# Altium schematic sheet MCU2.SchDoc: MCU
size A3; Date: 3/31/2015; Author: P.A.; CompanyName: STMicroelectronics; Organization: Microcontrollers Division; Address1: 12, Rue Jules HOROWITZ; Address2: 38019 Grenoble; Address3: FRANCE; DocumentNumber: MB1209; Revision: D-02; SheetNumber: 2; SheetTotal: 11; Project: STM32F412G-DISCO; ModifiedDate: 6/2/2016
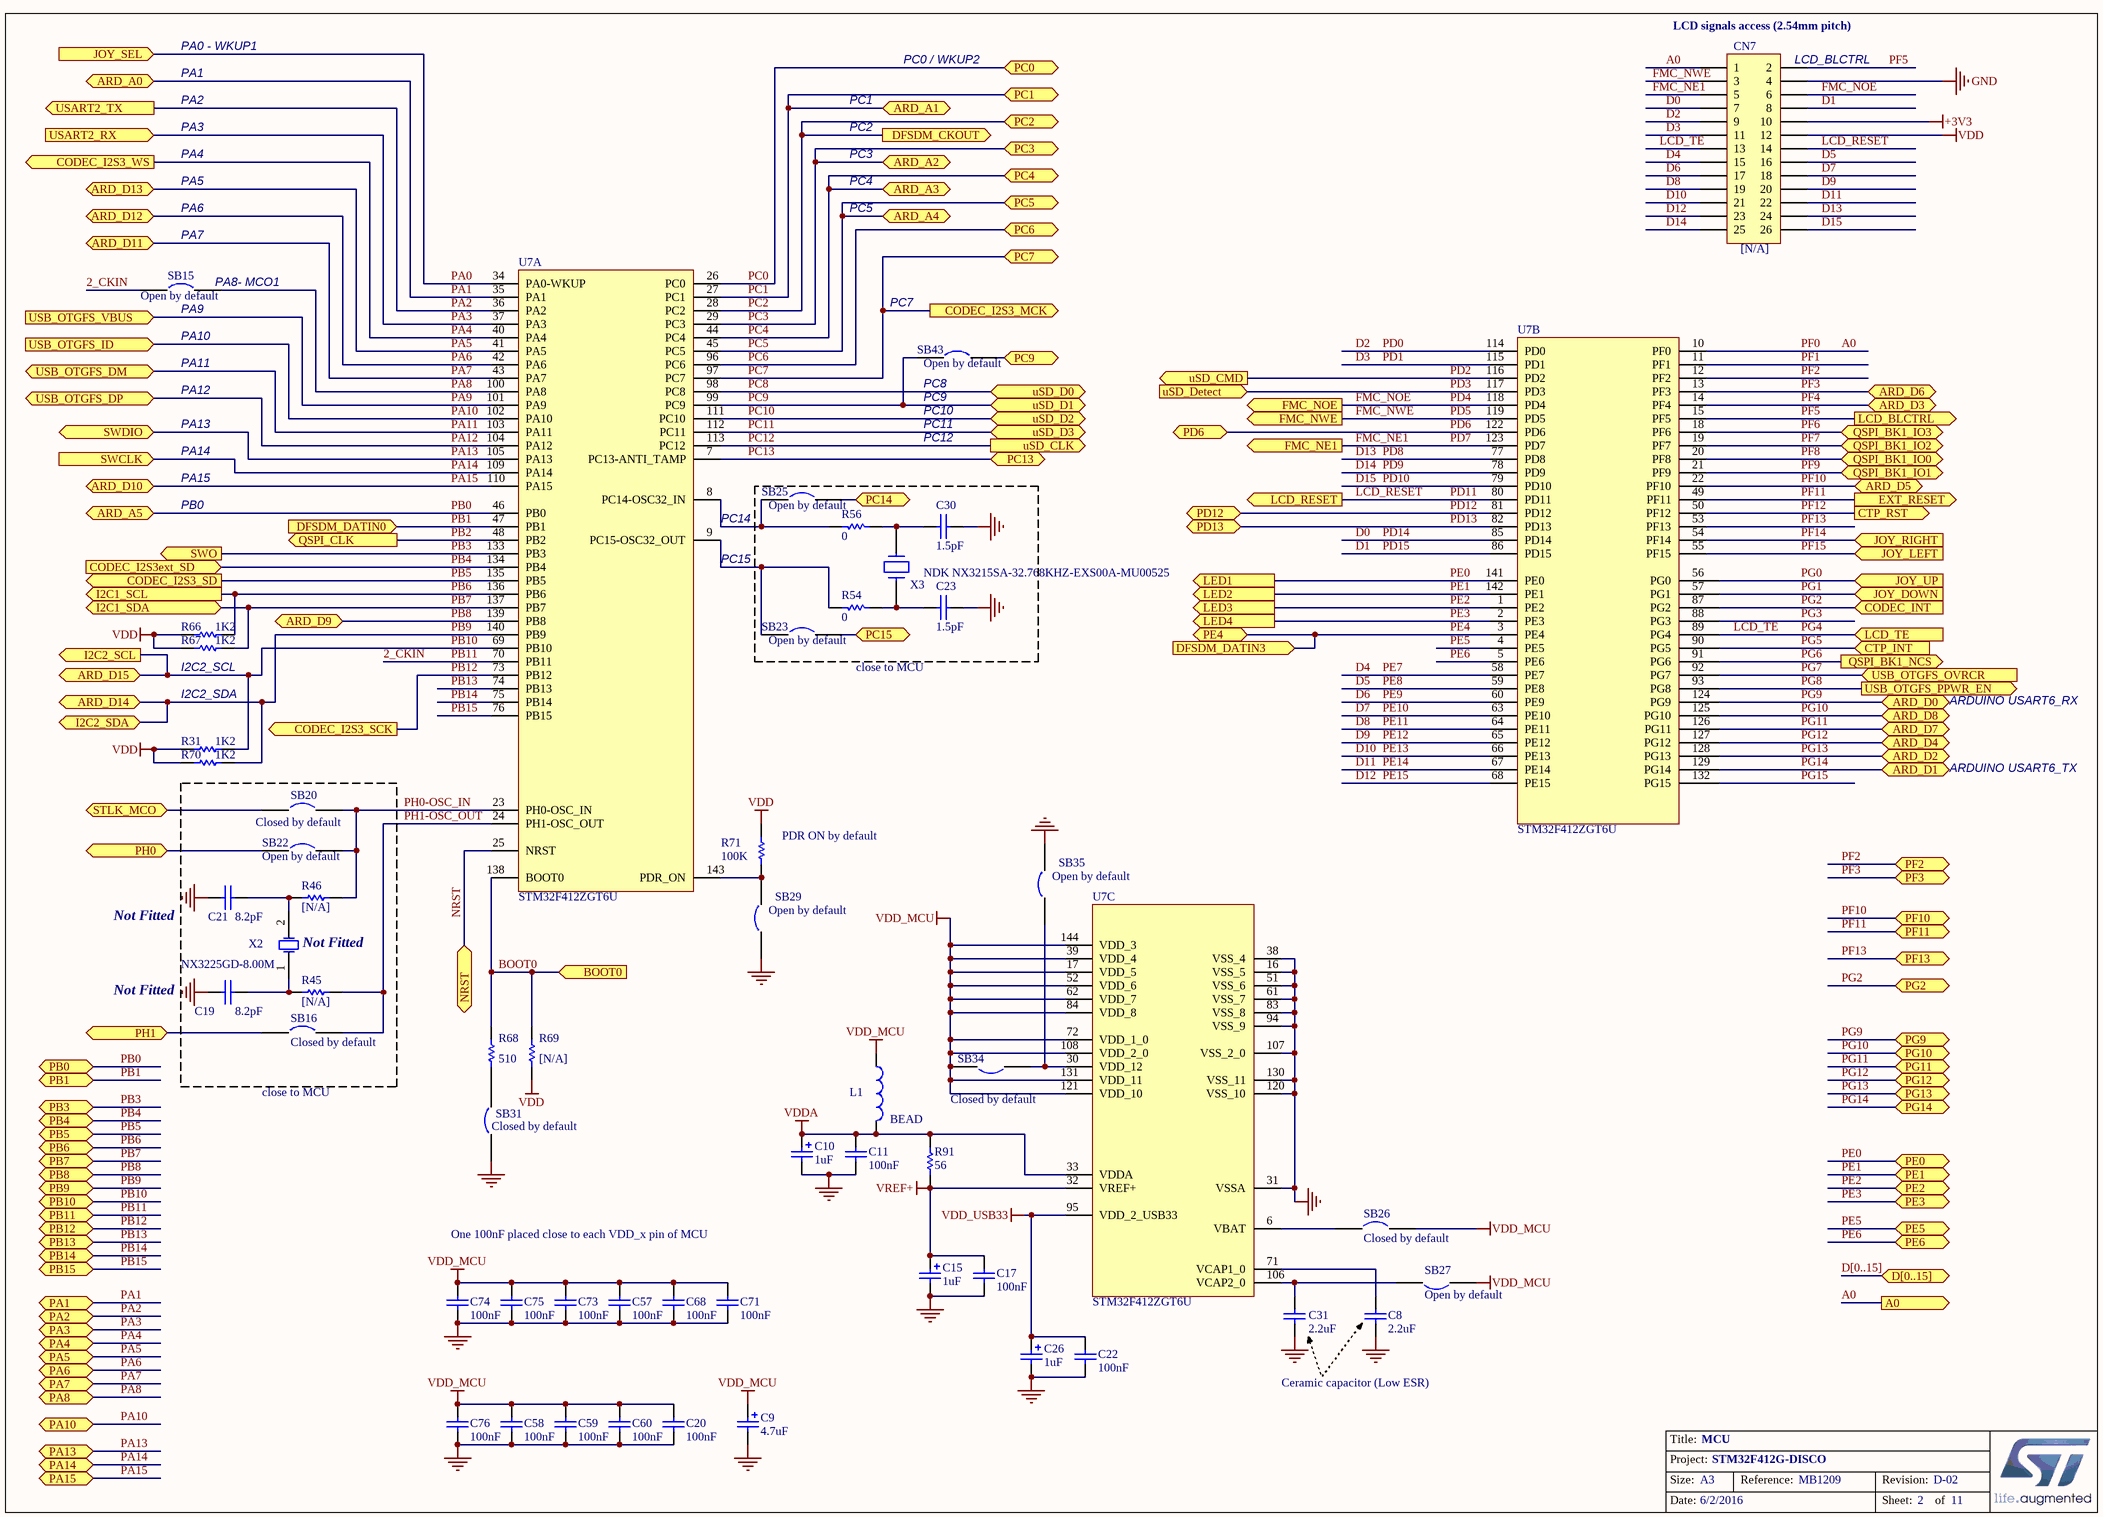
[diagram p0: MCU2.SchDoc]

## Parts
C8  2.2uF  [1206C]
C9  4.7uF  [TAN-A]
C10  1uF  [TAN-A]
C11  100nF  [0402C]
C15  1uF  [TAN-A]
C17  100nF  [0402C]
C19  8.2pF  [0603C]
C20  100nF  [0402C]
C21  8.2pF  [0603C]
C22  100nF  [0402C]
C23  1.5pF  [0603C]
C26  1uF  [TAN-A]
C30  1.5pF  [0603C]
C31  2.2uF  [1206C]
C57  100nF  [0402C]
C58  100nF  [0402C]
C59  100nF  [0402C]
C60  100nF  [0402C]
C68  100nF  [0402C]
C71  100nF  [0402C]
C73  100nF  [0402C]
C74  100nF  [0402C]
C75  100nF  [0402C]
C76  100nF  [0402C]
CN7  [N/A]  [HDR_2X13_2R54_W]
L1  BEAD  [0603L]
R31  1K2  [0603R]
R45  [N/A]  [0603R]
R46  [N/A]  [SB_0603]
R54  0  [SB_0603]
R56  0  [SB_0603]
R66  1K2  [0603R]
R67  1K2  [0603R]
R68  510  [0603R]
R69  [N/A]  [0603R]
R70  1K2  [0603R]
R71  100K  [0402R]
R91  56  [0603R]
SB15  Open by default  [SB_0603]
SB16  Closed by default  [SB_0603]
SB20  Closed by default  [SB_0603]
SB22  Open by default  [SB_0603]
SB23  Open by default  [SB_0603]
SB25  Open by default  [SB_0603]
SB26  Closed by default  [SB_0603]
SB27  Open by default  [SB_0603]
SB29  Open by default  [SB_0603]
SB31  Closed by default  [SB_0603]
SB34  Closed by default  [SB_0603]
SB35  Open by default  [SB_0603]
SB43  Open by default  [SB_0603]
U7  STM32F412ZGT6U  [TQFP144_0R5_22X22]  (parts A,B,C of 3)
X2  NX3225GD-8.00M  [XTAL_2SM_3R2X2R5]
X3  NDK NX3215SA-32.768KHZ-EXS00A-MU00525  [XTAL_2SM_3R2X1R5]

## Blocks framed on the sheet
Not Fitted: C19 C21 R45 R46 SB16 SB20 SB22 X2

## Ports
A0 (out), ARD_A0, ARD_A1, ARD_A2, ARD_A3, ARD_A4, ARD_A5, ARD_D0, ARD_D1, ARD_D2, ARD_D3 (bidir), ARD_D4, ARD_D5, ARD_D6, ARD_D7, ARD_D8, ARD_D9, ARD_D10, ARD_D11, ARD_D12, ARD_D13, ARD_D14, ARD_D15, BOOT0 (in), CODEC_I2S3_MCK (out), CODEC_I2S3_SCK (out), CODEC_I2S3_SD (out), CODEC_I2S3_WS (out), CODEC_I2S3ext_SD (in), CODEC_INT (in), CTP_INT (in), CTP_RST (out), D[0..15] (bidir), DFSDM_CKOUT (out), DFSDM_DATIN0 (in), DFSDM_DATIN3 (in), EXT_RESET (out), FMC_NE1 (out), FMC_NOE (out), FMC_NWE (out), I2C1_SCL (out), I2C1_SDA (bidir), I2C2_SCL (out), I2C2_SDA (bidir), JOY_DOWN (in), JOY_LEFT (in), JOY_RIGHT (in), JOY_SEL (in), JOY_UP (in), LCD_BLCTRL (out), LCD_RESET (out), LCD_TE (in), LED1 (out), LED2 (out), LED3 (out), LED4 (out), NRST (bidir), PA1, PA2, PA3, PA4, PA5, PA6, PA7, PA8, PA10, PA13, PA14, PA15, PB0, PB1, PB3, PB4, PB5, PB6, PB7, PB8, PB9, PB10, PB11, PB12, PB13, PB14, PB15, PC0, PC1, PC2, PC3, PC4, PC5, PC6, PC7, PC9 (bidir), PC13, PC14, PC15, PD6, PD12, PD13, PE0, PE1, PE2, PE3, PE4, PE5, PE6, PF2, PF3, PF10, PF11, PF13, PG2, PG9, PG10, PG11, PG12, PG13, PG14, PH0, PH1, QSPI_BK1_IO0 (bidir), QSPI_BK1_IO1 (bidir), QSPI_BK1_IO2 (bidir), QSPI_BK1_IO3 (bidir), QSPI_BK1_NCS (out), QSPI_CLK (out), STLK_MCO, SWCLK (in), SWDIO (bidir), SWO (out), USART2_RX (in), USART2_TX (out), USB_OTGFS_DM (bidir), USB_OTGFS_DP (bidir), USB_OTGFS_ID (in), USB_OTGFS_OVRCR (in), USB_OTGFS_PPWR_EN (out), USB_OTGFS_VBUS (in), uSD_CLK (out), uSD_CMD (out), uSD_D0 (bidir), uSD_D1 (bidir), uSD_D2 (bidir), uSD_D3 (bidir), uSD_Detect (in)

## Nets
+3V3: CN7.10
GND: C8.2 C9.2 C10.2 C11.1 C15.2 C17.1 C19.2 C20.2 C21.2 C22.1 C23.2 C26.2 C30.2 C31.2 C57.2 C58.2 C59.2 C60.2 C68.2 C71.2 C73.2 C74.2 C75.2 C76.2 CN7.4 SB29.1 SB31.1 SB35.2 U7.16(VSS_5) U7.31(VSSA) U7.38(VSS_4) U7.51(VSS_6) U7.61(VSS_7) U7.83(VSS_8) U7.94(VSS_9) U7.107(VSS_2_0) U7.120(VSS_10) U7.130(VSS_11)
VDD: CN7.12 R31.1 R66.1 R67.1 R69.2 R70.1 R71.1
VDD_MCU: C9.1 C20.1 C57.1 C58.1 C59.1 C60.1 C68.1 C71.1 C73.1 C74.1 C75.1 C76.1 L1.1 SB26.2 SB27.1 SB34.2 U7.17(VDD_5) U7.39(VDD_4) U7.52(VDD_6) U7.62(VDD_7) U7.72(VDD_1_0) U7.84(VDD_8) U7.108(VDD_2_0) U7.121(VDD_10) U7.131(VDD_11) U7.144(VDD_3)
VDD_USB33: C22.2 C26.1 U7.95(VDD_2_USB33)
VDDA: C10.1 C11.2 L1.2 R91.2 U7.33(VDDA)
VREF+: C15.1 C17.2 R91.1 U7.32(VREF+)
2_CKIN: SB15.1 U7.70(PB11) ; port PB11  [also labelled PB11]
A0: CN7.1 U7.10(PF0) ; port A0  [also labelled PF0]
BOOT0: R68.1 R69.1 U7.138(BOOT0) ; port BOOT0
D0: CN7.7 U7.85(PD14)  [also labelled PD14]
D1: CN7.8 U7.86(PD15)  [also labelled PD15]
D2: CN7.9 U7.114(PD0)  [also labelled PD0]
D3: CN7.11 U7.115(PD1)  [also labelled PD1]
D4: CN7.15 U7.58(PE7)  [also labelled PE7]
D5: CN7.16 U7.59(PE8)  [also labelled PE8]
D6: CN7.17 U7.60(PE9)  [also labelled PE9]
D7: CN7.18 U7.63(PE10)  [also labelled PE10]
D8: CN7.19 U7.64(PE11)  [also labelled PE11]
D9: CN7.20 U7.65(PE12)  [also labelled PE12]
D10: CN7.21 U7.66(PE13)  [also labelled PE13]
D11: CN7.22 U7.67(PE14)  [also labelled PE14]
D12: CN7.23 U7.68(PE15)  [also labelled PE15]
D13: CN7.24 U7.77(PD8)  [also labelled PD8]
D14: CN7.25 U7.78(PD9)  [also labelled PD9]
D15: CN7.26 U7.79(PD10)  [also labelled PD10]
FMC_NE1: CN7.5 U7.123(PD7) ; port FMC_NE1  [also labelled PD7]
FMC_NOE: CN7.6 U7.118(PD4) ; port FMC_NOE  [also labelled PD4]
FMC_NWE: CN7.3 U7.119(PD5) ; port FMC_NWE  [also labelled PD5]
LCD_RESET: CN7.14 U7.80(PD11) ; port LCD_RESET  [also labelled PD11]
LCD_TE: CN7.13 U7.89(PG4) ; port LCD_TE  [also labelled PG4]
NRST: U7.25(NRST) ; port NRST
PA0: U7.34(PA0-WKUP) ; port JOY_SEL
PA1: U7.35(PA1) ; port ARD_A0, port PA1
PA2: U7.36(PA2) ; port USART2_TX, port PA2
PA3: U7.37(PA3) ; port USART2_RX, port PA3
PA4: U7.40(PA4) ; port CODEC_I2S3_WS, port PA4
PA5: U7.41(PA5) ; port ARD_D13, port PA5
PA6: U7.42(PA6) ; port ARD_D12, port PA6
PA7: U7.43(PA7) ; port ARD_D11, port PA7
PA8: SB15.2 U7.100(PA8) ; port PA8
PA9: U7.101(PA9) ; port USB_OTGFS_VBUS
PA10: U7.102(PA10) ; port USB_OTGFS_ID, port PA10
PA11: U7.103(PA11) ; port USB_OTGFS_DM
PA12: U7.104(PA12) ; port USB_OTGFS_DP
PA13: U7.105(PA13) ; port SWDIO, port PA13
PA14: U7.109(PA14) ; port SWCLK, port PA14
PA15: U7.110(PA15) ; port ARD_D10, port PA15
PB0: U7.46(PB0) ; port ARD_A5, port PB0
PB1: U7.47(PB1) ; port DFSDM_DATIN0, port PB1
PB2: U7.48(PB2) ; port QSPI_CLK
PB3: U7.133(PB3) ; port SWO, port PB3
PB4: U7.134(PB4) ; port CODEC_I2S3ext_SD, port PB4
PB5: U7.135(PB5) ; port CODEC_I2S3_SD, port PB5
PB6: R66.2 U7.136(PB6) ; port I2C1_SCL, port PB6
PB7: R67.2 U7.137(PB7) ; port I2C1_SDA, port PB7
PB8: U7.139(PB8) ; port ARD_D9, port PB8
PB9: R70.2 U7.140(PB9) ; port ARD_D14, port PB9, port I2C2_SDA
PB10: R31.2 U7.69(PB10) ; port ARD_D15, port PB10, port I2C2_SCL
PB12: U7.73(PB12) ; port CODEC_I2S3_SCK, port PB12
PB13: U7.74(PB13) ; port PB13
PB14: U7.75(PB14) ; port PB14
PB15: U7.76(PB15) ; port PB15
PC0: U7.26(PC0) ; port PC0
PC1: U7.27(PC1) ; port ARD_A1, port PC1
PC2: U7.28(PC2) ; port DFSDM_CKOUT, port PC2
PC3: U7.29(PC3) ; port ARD_A2, port PC3
PC4: U7.44(PC4) ; port ARD_A3, port PC4
PC5: U7.45(PC5) ; port ARD_A4, port PC5
PC6: U7.96(PC6) ; port PC6
PC7: U7.97(PC7) ; port CODEC_I2S3_MCK, port PC7
PC8: U7.98(PC8) ; port uSD_D0
PC9: SB43.1 U7.99(PC9) ; port uSD_D1
PC9: SB43.2 ; port PC9  [a separate net that carries the same name]
PC10: U7.111(PC10) ; port uSD_D2
PC11: U7.112(PC11) ; port uSD_D3
PC12: U7.113(PC12) ; port uSD_CLK
PC13: U7.7(PC13-ANTI_TAMP) ; port PC13
PC14: SB25.2 ; port PC14
PC15: SB23.2 ; port PC15
PD2: U7.116(PD2) ; port uSD_CMD
PD3: U7.117(PD3) ; port uSD_Detect
PD6: U7.122(PD6) ; port PD6
PD12: U7.81(PD12) ; port PD12
PD13: U7.82(PD13) ; port PD13
PE0: U7.141(PE0) ; port LED1, port PE0
PE1: U7.142(PE1) ; port LED2, port PE1
PE2: U7.1(PE2) ; port LED3, port PE2
PE3: U7.2(PE3) ; port LED4, port PE3
PE4: U7.3(PE4) ; port PE4, port DFSDM_DATIN3
PE5: U7.4(PE5) ; port PE5
PE6: U7.5(PE6) ; port PE6
PF1: U7.11(PF1)
PF2: U7.12(PF2) ; port PF2
PF3: U7.13(PF3) ; port PF3, port ARD_D6
PF4: U7.14(PF4) ; port ARD_D3
PF5: CN7.2 U7.15(PF5) ; port LCD_BLCTRL
PF6: U7.18(PF6) ; port QSPI_BK1_IO3
PF7: U7.19(PF7) ; port QSPI_BK1_IO2
PF8: U7.20(PF8) ; port QSPI_BK1_IO0
PF9: U7.21(PF9) ; port QSPI_BK1_IO1
PF10: U7.22(PF10) ; port ARD_D5, port PF10
PF11: U7.49(PF11) ; port EXT_RESET, port PF11
PF12: U7.50(PF12) ; port CTP_RST
PF13: U7.53(PF13) ; port PF13
PF14: U7.54(PF14) ; port JOY_RIGHT
PF15: U7.55(PF15) ; port JOY_LEFT
PG0: U7.56(PG0) ; port JOY_UP
PG1: U7.57(PG1) ; port JOY_DOWN
PG2: U7.87(PG2) ; port CODEC_INT, port PG2
PG3: U7.88(PG3)
PG5: U7.90(PG5) ; port CTP_INT
PG6: U7.91(PG6) ; port QSPI_BK1_NCS
PG7: U7.92(PG7) ; port USB_OTGFS_OVRCR
PG8: U7.93(PG8) ; port USB_OTGFS_PPWR_EN
PG9: U7.124(PG9) ; port ARD_D0, port PG9
PG10: U7.125(PG10) ; port ARD_D8, port PG10
PG11: U7.126(PG11) ; port ARD_D7, port PG11
PG12: U7.127(PG12) ; port ARD_D4, port PG12
PG13: U7.128(PG13) ; port ARD_D2, port PG13
PG14: U7.129(PG14) ; port ARD_D1, port PG14
PG15: U7.132(PG15)
PH0: SB22.1 ; port PH0
PH0-OSC_IN: R46.1 SB20.2 SB22.2 U7.23(PH0-OSC_IN)
PH1: SB16.1 ; port PH1
PH1-OSC_OUT: R45.1 SB16.2 U7.24(PH1-OSC_OUT)
STLK_MCO: SB20.1 ; port STLK_MCO
NetC8_1: C8.1 U7.71(VCAP1_0)
NetC19_1: C19.1 R45.2 X2.1(OSC1)
NetC21_1: C21.1 R46.2 X2.2(OSC2)
NetC23_1: C23.1 R54.1 X3.1
NetC30_1: C30.1 R56.1 X3.2
NetC31_1: C31.1 SB27.2 U7.106(VCAP2_0)
NetR54_2: R54.2 SB23.1 U7.9(PC15-OSC32_OUT)
NetR56_2: R56.2 SB25.1 U7.8(PC14-OSC32_IN)
NetR68_2: R68.2 SB31.2
NetR71_2: R71.2 SB29.2 U7.143(PDR_ON)
NetSB26_1: SB26.1 U7.6(VBAT)
NetSB34_1: SB34.1 SB35.1 U7.30(VDD_12)

## Buses and harness runs
bus D[0..15] = port D[0..15]

## Notes on the sheet
- PA0 - WKUP1
- (near CN7) LCD signals access (2.54mm pitch)
- PA1
- PA2
- PC1
- PC0 / WKUP2
- (near CN7) LCD_BLCTRL
- PA4
- PA5
- PA3
- PC2
- PC3
- PC4
- PA6
- (near SB15) PA7
- PC5
- (near SB15) PA9
- (near SB15) PA8- MCO1
- PC7
- (near SB15) PA10
- PA11
- (near SB43) PC8
- PA12
- PA13
- PA14
- (near SB43) PC9
- (near SB43) PC10
- PC11
- PC12
- PA15
- PB0
- (near U7) PC14
- (near U7) PC15
- (near R67) I2C2_SCL
- I2C2_SDA
- close to MCU
- ARDUINO USART6_RX
- ARDUINO USART6_TX
- (near R71) PDR ON by default
- (near C21) Not Fitted
- (near C19) Not Fitted
- One 100nF placed close to each VDD_x pin of MCU
- Ceramic capacitor (Low ESR)
- Title:
- Project:
- Size:
- Date:
- A3
- Reference:
- Sheet:
- Revision:
- of

## Library data of the parts
C8 C11 C17 C22 C31 = Cap: Capacitor; Value: 10nF; Ordered by: Subcon; ECCN_US/EU: NA; Published: 8-Jun-2000; Revision: July-2002: Re-released for DXP Platform.; Publisher: Altium Limited
C9 = Cap Pol1: Polarized Capacitor (Radial); Value: 47uF; Ordered by: Subcon; ECCN_US/EU: NA; Published: 8-Jun-2000; Revision: July-2002: Re-released for DXP Platform.; Publisher: Altium Limited
C10 C15 C26 = Cap Pol1: Polarized Capacitor (Radial); Value: 10uF; Ordered by: Subcon; ECCN_US/EU: NA; Published: 8-Jun-2000; Revision: July-2002: Re-released for DXP Platform.; Publisher: Altium Limited
C19 C21 = CAP: Capacitor; Ordered by: Subcon; Fitted: NO; ECCN_US/EU: NA
C20 C23 C30 C57-C60 C68 C71 C73-C76 = CAP: Capacitor; Ordered by: Subcon; ECCN_US/EU: NA
  C20 C57-C60 C68 C71 C73-C76: Published: 8-Jun-2000; Revision: July-2002: Re-released for DXP Platform.; Publisher: Altium Limited; Value: 100nF
CN7 = Header 13X2: Header, 13-Pin, Dual row; Ordered by: Subcon; Assembly: CN6 not mounted; Fitted: NO; ECCN_US/EU: NA; LatestRevisionDate: 17-Jul-2002; LatestRevisionNote: Re-released for DXP Platform.; Publisher: Altium Limited
L1 = Inductor: Manuf_1: Tai-tech; Manuf_Part_1: FCM1608KF-601T03; Value: 100uH; Ordered by: Subcon; ECCN_US/EU: NA; Published: 8-Jun-2000; Revision: July-2002: Re-released for DXP Platform.; Publisher: Altium Limited
R31 R54 R56 R66 R67 R70 R71 R91 = Res1: Resistor; Value: 1K; Ordered by: Subcon; ECCN_US/EU: NA; Published: 8-Jun-2000; Revision: July-2002: Re-released for DXP Platform.; Publisher: Altium Limited
R45 R46 = Res1: Resistor; Value: 1K; Ordered by: Subcon; Fitted: NO; ECCN_US/EU: NA; Published: 8-Jun-2000; Revision: July-2002: Re-released for DXP Platform.; Publisher: Altium Limited
R68 = res1: Resistor; Value: 1K; Ordered by: Subcon; ECCN_US/EU: NA; Published: 8-Jun-2000; Revision: July-2002: Re-released for DXP Platform.; Publisher: Altium Limited
R69 = res1: Resistor; Value: 1K; Ordered by: Subcon; Fitted: NO; ECCN_US/EU: NA; Published: 8-Jun-2000; Revision: July-2002: Re-released for DXP Platform.; Publisher: Altium Limited
SB15 SB22 SB23 SB25 SB27 SB29 SB35 SB43 = Circuit Breaker: Ordered by: Subcon; Comments: Solder bridge; Fitted: NO; ECCN_US/EU: NA; Published: 24-Mar-1999; Revision: July-2002: Re-released for DXP Platform.; Publisher: Altium Limited
SB16 SB20 SB26 SB31 SB34 = Circuit Breaker: Ordered by: Subcon; Comments: Solder bridge; ECCN_US/EU: NA; Published: 24-Mar-1999; Revision: July-2002: Re-released for DXP Platform.; Publisher: Altium Limited
U7 = Tiny_Manta_LP1M_LQFP144: Manuf_Part_1: STM32F412 cut 1.0; Ordered by: ST; Ref St: TBD; ECCN_US/EU: 3A991A2/NEC; Manuf_1: ST
X2 = XTAL_8M_NX3225GD: Crystal 8Mhz, 8pF, -+50PPM, SMD; Manuf_1: NDK; Manuf_Part_1: NX3225GD 8MHz EXS00A-CG04874; Manuf_Part_2: NX3225GD-8.000M-STD-CRA-3; ECCN_US/EU: EAR99/NEC; NDK Ref: X3127326; Ref St: 9157029; Provided: ST; Fitted: NO; Order: NX3225GD 8MHz EXS00A-CG04874; Ordered by: ST
X3 = CRYSTAL_32K: 32.768kHz Crystal; Ordered by: ST; ECCN_US/EU: EAR99/NEC; Ref St: 9157034; Manuf_1: NDK; Manuf_Part_1: NX3215SA-32.768KHZ-EXS00A-MU00525